# EAGLE design TPS61020DRCRG4 breakout (EAGLE 6.2)
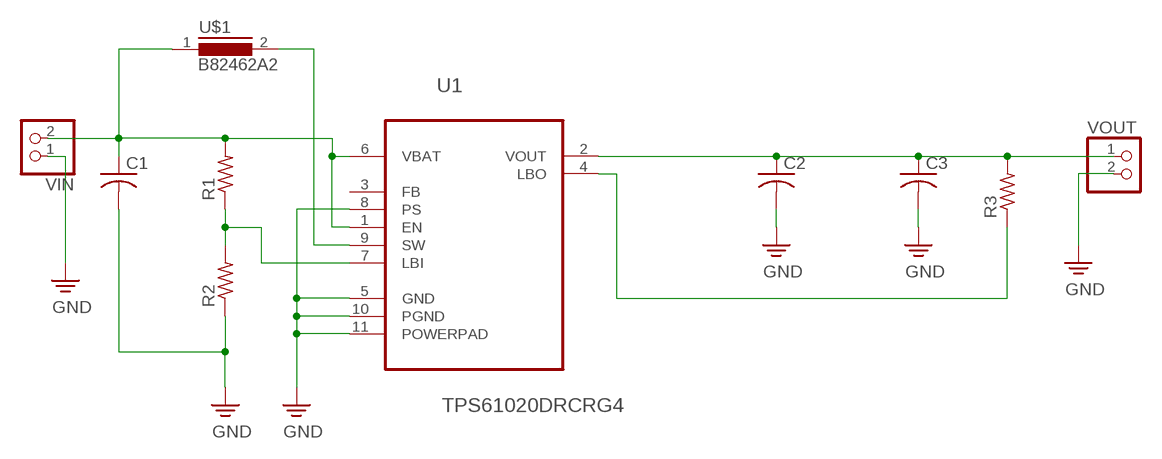
[diagram p0: schematic, sheet 1]

## Parts
C1  C-USC0805  [C0805]
C2  C-USC0805  [C0805]
C3  C-USC1206  [C1206]
R1  R-US_R0805  [R0805]
R2  R-US_R0805  [R0805]
R3  R-US_R0805  [R0805]
U1  TPS61020DRCRG4  [SON50P300X300X100-11N]
U$1  B82462A2  [B8246A2682]
VIN  PINHD-1X2  [1X02]
VOUT  PINHD-1X2  [1X02]

## Nets
N$1: C2.1 C3.1 R3.2 U1.2(VOUT) VOUT.1
N$2: R1.1 R2.2 U1.7(LBI)
N$3: R3.1 U1.4(LBO)
N$4: C1.1 R1.2 U1.1(EN) U1.6(VBAT) U$1.1 VIN.2
N$6: U1.9(SW) U$1.2
PE: C1.2 C2.2 C3.2 R2.1 U1.5(GND) U1.8(PS) U1.10(PGND) U1.11(POWERPAD) VIN.1 VOUT.2 ; supply symbol labelled GND
Unconnected: U1.3(FB)

## Library data of the parts
C1-C3 = rcl:C-US: CAPACITOR, American symbol
R1-R3 = rcl:R-US_: RESISTOR, American symbol
U1 = TI-TPS61020DRCRG4:TPS61020DRCRG4: 96% EFFICIENT SYNCHRONOUS BOOST CONVERTER; MPN: TPS61020DRCRG4; OC_FARNELL: 9969160; OC_NEWARK: 79K3407; PACKAGE: SON-10; SUPPLIER: Texas Instruments
U$1 = B82462A2:B82462A2: INDUCTOR, POWER, 6.8UH, 1.28A, 20% Inductance: 6.8µH Inductance Tolerance: ± 20% DC Resistance Max: 0.125ohm DC Current Rating: 1.28A Core Material: Ferrite Inductor Case Style: SMD No. of Pins: 2 Core Material: Ferrite DC Current Max: 1.28A Inductance Measurement Frequency: 0.1MHz Inductor Type: Power Package / Case: SMD Resistance: 0.125ohm
VIN VOUT = pinhead:PINHD-1X2: PIN HEADER

## Net classes
0 default: width 0.203 mm

## Board
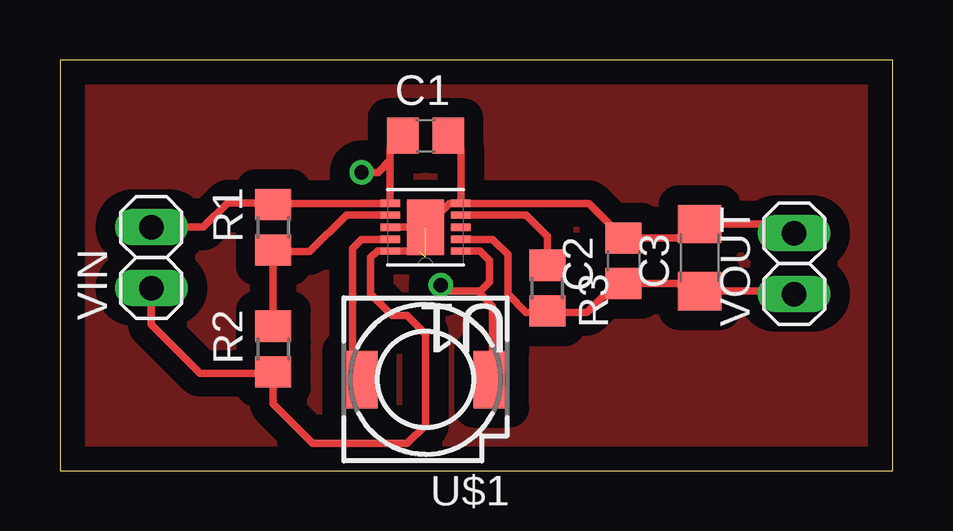
[diagram p1: board, top side]
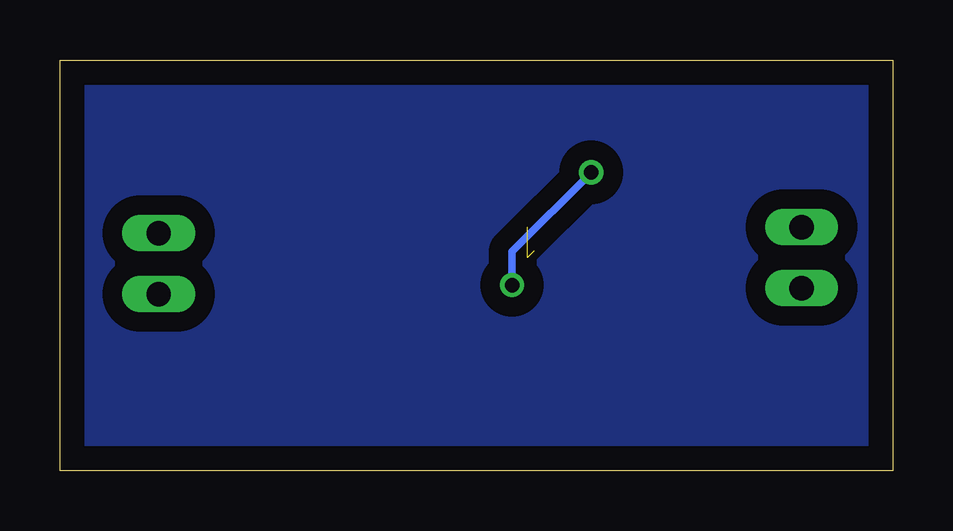
[diagram p2: board, bottom side, seen from below]

Size 34.72 x 17.14 mm. Coordinates in mm from the lower left corner, seen from the top.
Outline: 0,0 34.72,0 34.72,17.14 0,17.14 0,0
Copper layers (1*16): Top 0.035mm / dielectric 1.5mm / Bottom 0.035mm
Design rules: minimum track width 10mil, minimum drill 24mil, track to track 8mil, track to pad 8mil, pad to pad 8mil, via to via 8mil, smd to smd 8mil, copper to edge 40mil, drill to drill 8mil, minimum pad ring 10mil, minimum via ring 8mil, stop-mask expansion 4mil, vias tented up to drill 0mil, thermal gap 10mil

### Footprints (pad centres in the part's own frame; a part is rotated, then mirrored left to right if it is on the bottom)
C0805 = smd 1.3 x 1.5: 1 -0.95,0; 2 0.95,0
C1206 = smd 1.6 x 1.8: 1 -1.4,0; 2 1.4,0
R0805 = smd 1.3 x 1.5: 1 -0.95,0; 2 0.95,0
SON50P300X300X100-11N = smd 0.813 x 0.305: 1 -1.473,0.991; 2 -1.473,0.508; 3 -1.473,0; 4 -1.473,-0.508; 5 -1.473,-0.991; 6 1.473,-0.991; 7 1.473,-0.508; 8 1.473,0; 9 1.473,0.508; 10 1.473,0.991 | smd 1.549 x 2.311: 11 0,0
B8246A2682 = smd 1.5 x 2.4: 1 -2.75,0; 2 2.75,0
1X02 = drill 1.016 long: 1 -1.27,0; 2 1.27,0

### Placement (x,y rotation side)
C1  15.24,13.97 0 top
C2  23.5,8.76 90 top
C3  26.67,8.89 90 top
R1  8.89,10.16 90 top
R2  8.89,5.08 90 top
R3  20.32,7.62 270 top
U1  15.24,10.16 180 top
U$1  15.24,3.81 180 top
VIN  3.81,8.89 90 top
VOUT  30.61,8.64 90 top

### Tracks (layer width: path | path; a pad name or v marks a point on that pad's centre or on a via)
GND
  pour Top (isolate 0.813): 0.13,17.02 34.8,17.02 34.8,0 0.13,0
  pour Bottom (isolate 0.813): 0.13,16.89 34.67,16.89 34.67,0 0.13,0
N$1
  Top 0.305: U1.2 18.03,9.65 18.67,9.02 18.67,7.37 19.43,6.6 20.25,6.6 R3.2 20.39,6.6 21.97,6.6 23.18,7.81 C2.1 26.35,7.81 C3.1 30.48,7.49 VOUT.1
N$2
  Top 0.305: U1.7 11.94,10.67 10.41,9.14 8.96,9.14 R1.1 R2.2
N$3
  Top 0.305: U1.4 19.43,10.67 20.32,9.78 R3.1
N$4  (via drill 0.6)
  Top 0.305: 13.77,12.95 U1.6 8.93,11.15 R1.2 8.82,11.18 6.99,11.18 5.97,10.16 VIN.2 | 13.77,12.95 13.77,13.45 C1.1 | 17.78,4.02 U$1.1 18.03,3.85 18.03,6.86 17.53,7.37 17.53,7.49 | U1.1 17.5,9.17 17.91,8.76 17.91,7.87 17.53,7.49 | 17.53,7.49 16.13,7.49 v15.88,7.75 | v12.57,12.45 13.26,12.45 13.77,12.95
  Bottom 0.305: v15.88,7.75 15.88,9.14 v12.57,12.45
N$6
  Top 0.305: U1.9 12.57,9.65 12.19,9.27 12.19,4.11 U$1.2
PE  (2 unrouted)
  Top 0.305: U1.5 16.71,13.45 C1.2 | U1.8 U1.11 16.23,11.15 U1.5 | 14.96,9.17 U1.10 13.23,9.17 12.95,8.89 12.95,7.37 13.84,6.48 14.48,6.48 15.24,5.71 15.24,1.91 14.48,1.14 10.54,1.14 8.89,2.79 R2.1 8.82,4.06 5.84,4.06 3.81,6.1 VIN.1 | U1.5 22.06,11.15 C2.2 26.09,9.71 C3.2 30.22,10.29 VOUT.2